# EAGLE design shield (EAGLE 6.5.0)
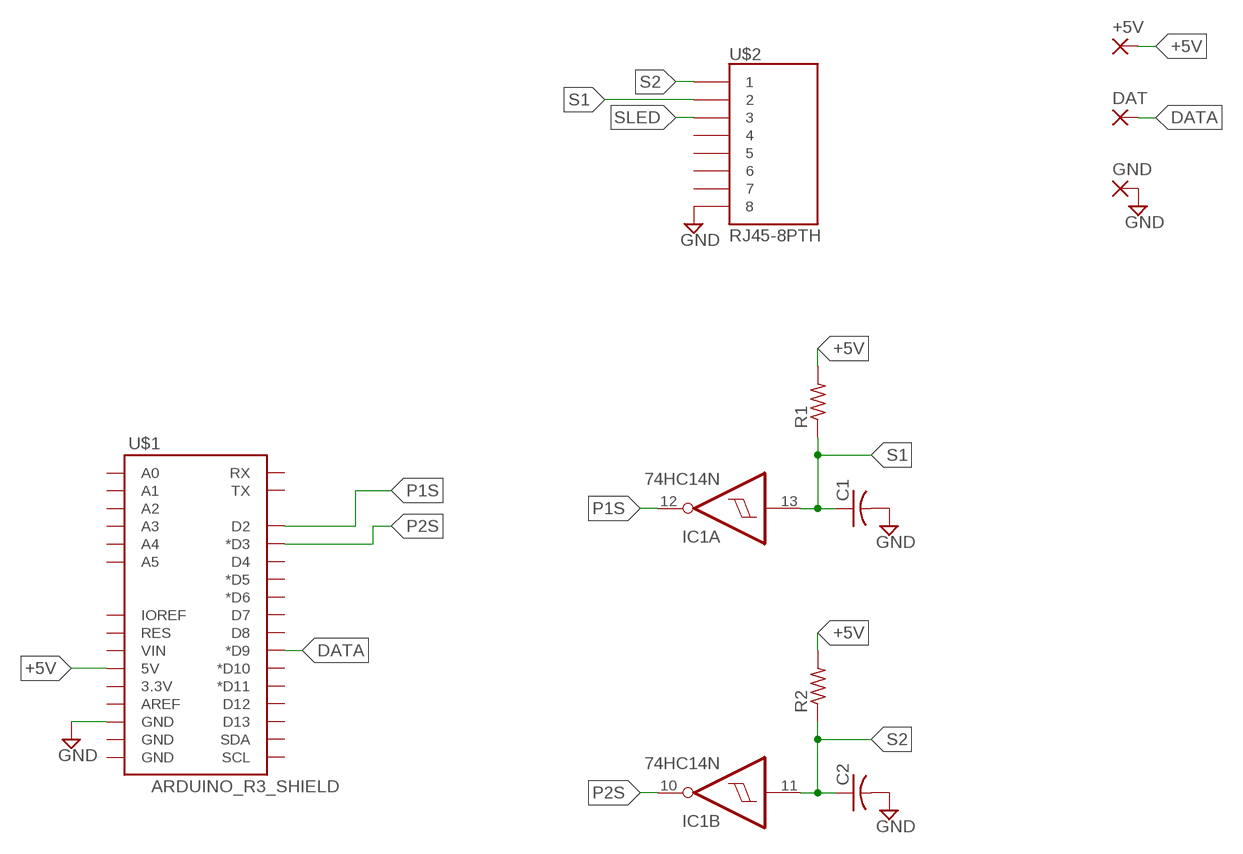
[diagram p0: schematic, sheet 1]

## Parts
+5V  WIREPAD2,15/1,0  [2,15/1,0]
C1  C-US025-025X050  [C025-025X050]
C2  C-US025-025X050  [C025-025X050]
DAT  WIREPAD2,15/1,0  [2,15/1,0]
GND  WIREPAD2,15/1,0  [2,15/1,0]
IC1  74HC14N  [DIL14]
R1  R-US_0207/7  [0207/7]
R2  R-US_0207/7  [0207/7]
U$1  ARDUINO_R3_SHIELD  [UNO_R3_SHIELD]
U$2  RJ45-8PTH  [RJ45-8]

## Nets
+5V: +5V.1(P) R1.2 R2.2 U$1.5V
DATA: DAT.1(P) U$1.D9(*D9)
GND: C1.2 C2.2 GND.1(P) U$1.GND@2(GND) U$2.8
P1S: IC1.12(A:O) U$1.D2
P2S: IC1.10(B:O) U$1.D3(*D3)
S1: C1.1 IC1.13(A:I) R1.1 U$2.2
S2: C2.1 IC1.11(B:I) R2.1 U$2.1
SLED: U$2.3
Unconnected: IC1.1(D:I) IC1.2(D:O) IC1.3(E:I) IC1.4(E:O) IC1.5(F:I) IC1.6(F:O) IC1.8(C:O) IC1.9(C:I) U$1.3.3V U$1.A0 U$1.A1 U$1.A2 U$1.A3 U$1.A4 U$1.A5 U$1.AREF U$1.D4 U$1.D5(*D5) U$1.D6(*D6) U$1.D7 U$1.D8 U$1.D10(*D10) U$1.D11(*D11) U$1.D12 U$1.D13 U$1.GND@0(GND) U$1.GND@1(GND) U$1.IOREF U$1.RES U$1.RX U$1.SCL U$1.SDA U$1.TX U$1.VIN U$2.4 U$2.5 U$2.6 U$2.7

## Power pins joined to a net without a drawn wire
GND: IC1.7(P:GND)
VCC: IC1.14(P:VCC)

## Library data of the parts
+5V DAT GND = wirepad:WIREPAD: Wire PAD connect wire on PCB
C1 C2 = resistor:C-US: CAPACITOR, American symbol
IC1 = 74xx-eu:74*14: Hex schmitt trigger INVERTER
R1 R2 = resistor:R-US_: RESISTOR, American symbol
U$1 = SparkFun-Boards:ARDUINO_R3_SHIELD: Shield form compatible with the Arduino Uno R3.
U$2 = SparkFun-Connectors:RJ45-8: RJ45 Jack Simple RJ45, 8-pin connection - connector for common Cat5, Cat5e, and Cat6 Ethernet cables. Footprint not yet proven in production. Connector sku is PRT-00643; Breakout PCB sku is BOB-00716.

## Board
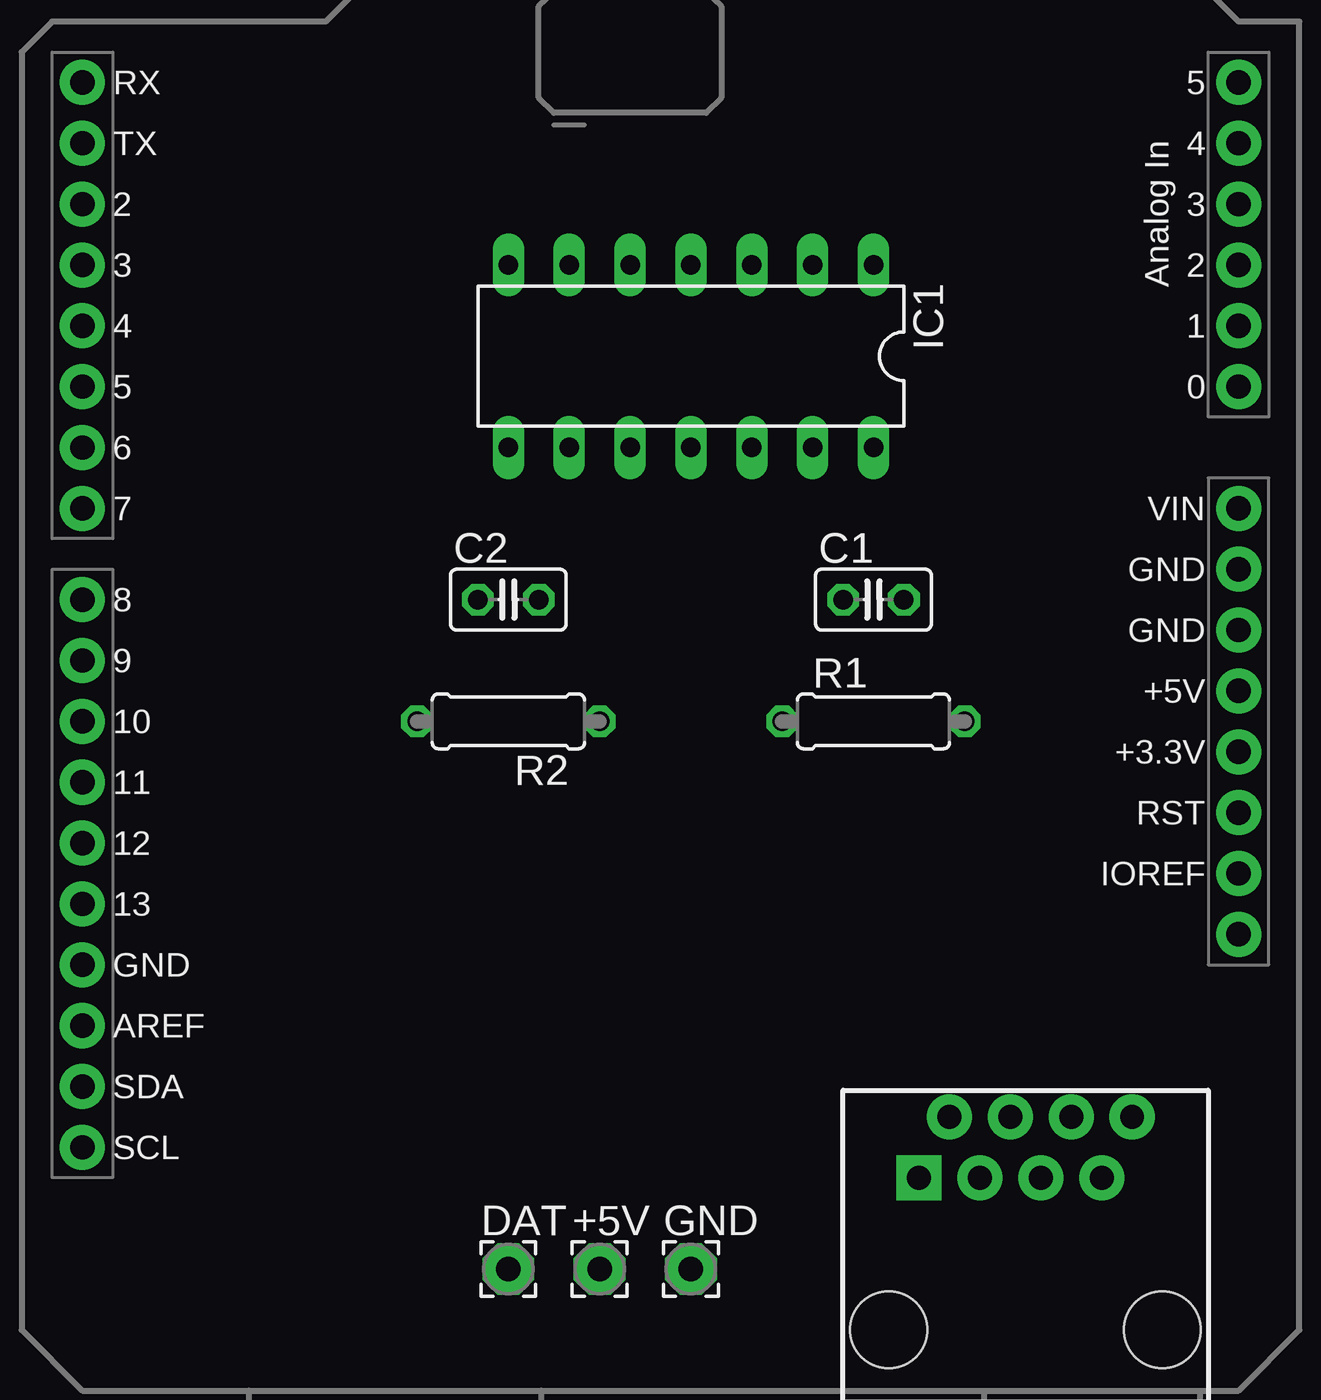
[diagram p1: board, top side]
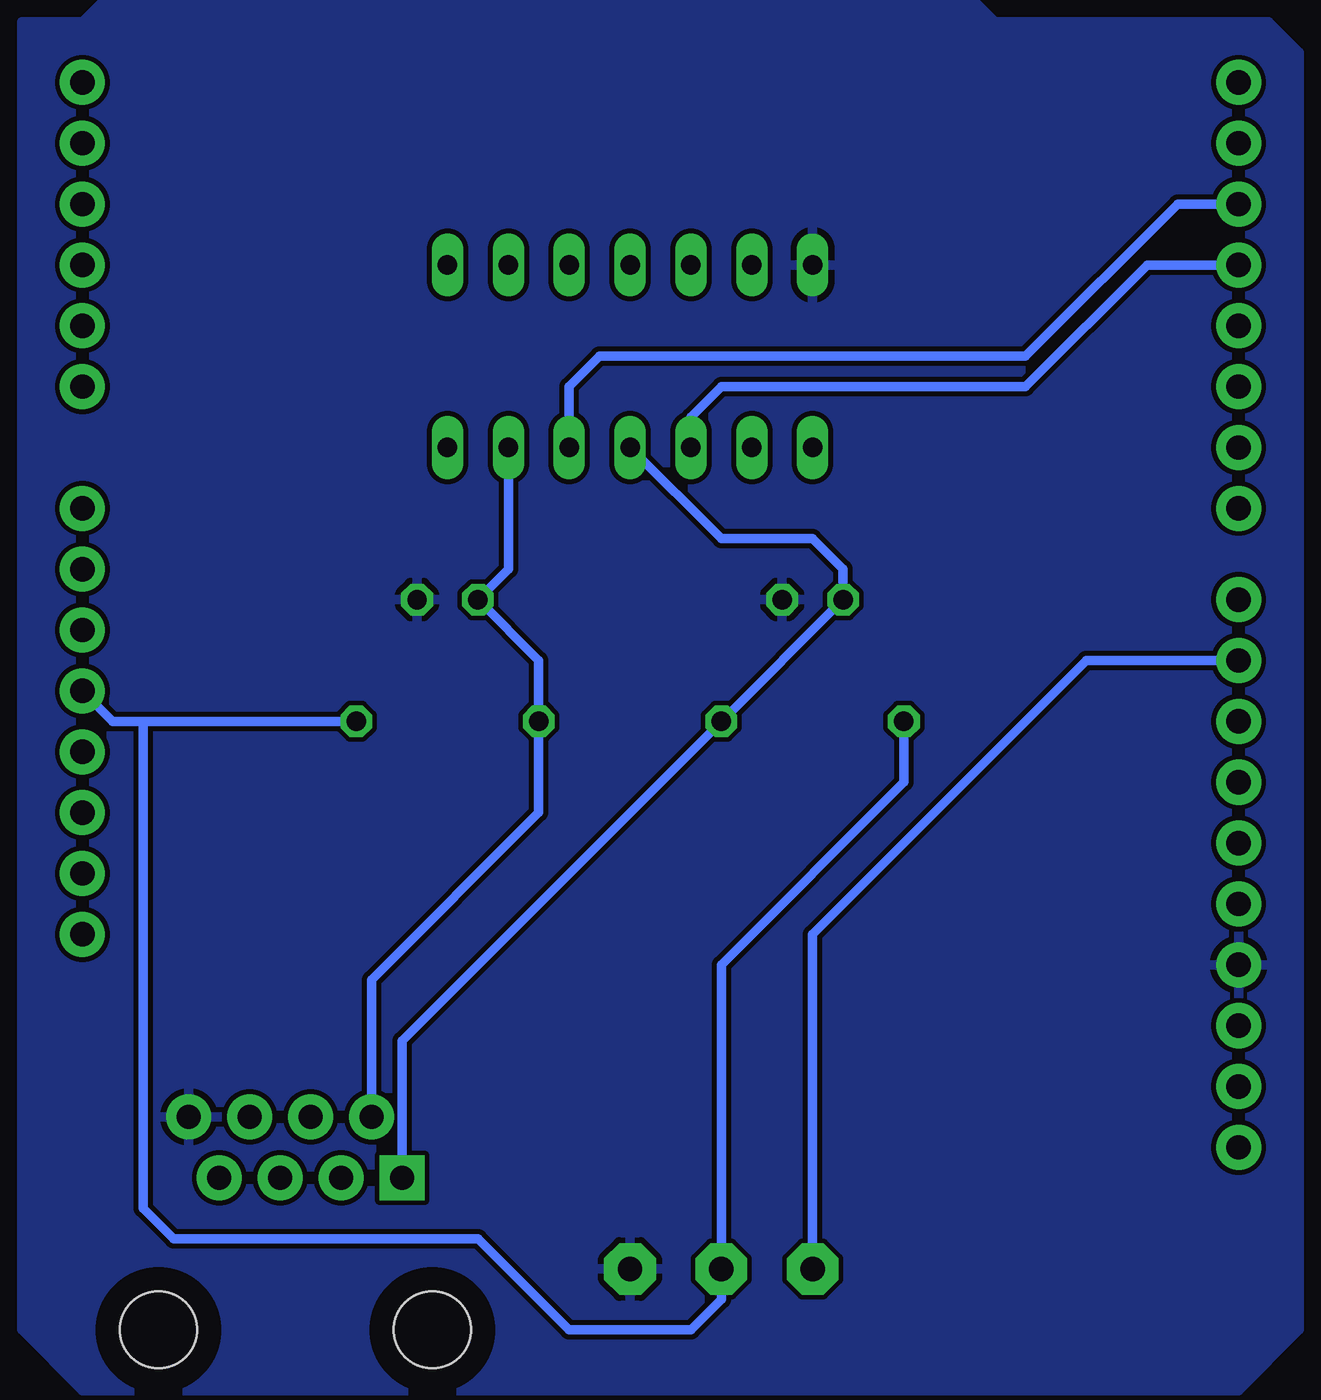
[diagram p2: board, bottom side, seen from below]

No outline drawn. Coordinates in mm, seen from the top.
Copper layers (1*16): Top 0.035mm / dielectric 1.5mm / Bottom 0.035mm
Design rules "default": minimum track width 10mil, minimum drill 24mil, track to track 8mil, track to pad 8mil, pad to pad 8mil, via to via 8mil, smd to smd 8mil, copper to edge 40mil, drill to drill 8mil, minimum pad ring 10mil, minimum via ring 8mil, stop-mask expansion 4mil, vias tented up to drill 0mil, thermal gap 10mil

### Footprints (pad centres in the part's own frame; a part is rotated, then mirrored left to right if it is on the bottom)
2,15/1,0 = drill 1.016 pad 2.159 octagon: 1 0,0
C025-025X050 = drill 0.813 octagon: 1 -1.27,0; 2 1.27,0
DIL14 = drill 0.813 long: 1 -7.62,-3.81; 2 -5.08,-3.81; 3 -2.54,-3.81; 4 0,-3.81; 5 2.54,-3.81; 6 5.08,-3.81; 7 7.62,-3.81; 8 7.62,3.81; 9 5.08,3.81; 10 2.54,3.81; 11 0,3.81; 12 -2.54,3.81; 13 -5.08,3.81; 14 -7.62,3.81
0207/7 = drill 0.813 octagon: 1 -3.81,0; 2 3.81,0
UNO_R3_SHIELD = drill 1.016 pad 1.88: 3.3V 50.8,26.67; 5V 50.8,29.21; A0 50.8,41.91; A1 50.8,44.45; A2 50.8,46.99; A3 50.8,49.53; A4 50.8,52.07; A5 50.8,54.61; AREF 2.54,15.24; D2 2.54,49.53; D3 2.54,46.99; D4 2.54,44.45; D5 2.54,41.91; D6 2.54,39.37; D7 2.54,36.83; D8 2.54,33.02; D9 2.54,30.48; D10 2.54,27.94; D11 2.54,25.4; D12 2.54,22.86; D13 2.54,20.32; GND@0 50.8,31.75; GND@1 50.8,34.29; GND@2 2.54,17.78; IOREF 50.8,21.59; NC 50.8,19.05; RES 50.8,24.13; RX 2.54,54.61; SCL 2.54,10.16; SDA 2.54,12.7; TX 2.54,52.07; VIN 50.8,36.83
RJ45-8 = drill 1 pad 1.88 square: 1 -4.445,6.35 | drill 1 pad 1.88: 2 -3.175,8.89; 3 -1.905,6.35; 4 -0.635,8.89; 5 0.635,6.35; 6 1.905,8.89; 7 3.175,6.35; 8 4.445,8.89 | hole 3.2: -5.715,0; 5.715,0

### Placement (x,y rotation side)
+5V  24.13,5.08 0 top
C1  35.56,33.02 0 top
C2  20.32,33.02 0 top
DAT  20.32,5.08 0 top
GND  27.94,5.08 0 top
IC1  27.94,43.18 180 top
R1  35.56,27.94 0 top
R2  20.32,27.94 180 top
U$1  0,0 0 top
U$2  41.91,2.54 0 top

### Tracks (layer width: path | path; a pad name or v marks a point on that pad's centre or on a via)
+5V
  Bottom 0.406: U$1.5V 49.53,27.94 48.26,27.94 | 48.26,27.94 R1.2 | 48.26,27.94 48.26,7.62 46.99,6.35 34.29,6.35 30.48,2.54 25.4,2.54 24.13,3.81 +5V.1 24.13,17.78 16.51,25.4 R2.2
DATA
  Bottom 0.406: DAT.1 20.32,19.05 8.89,30.48 U$1.D9
GND
  pour Bottom: 15.24,59.69 48.26,59.69 50.8,57.15 53.34,57.15 53.34,2.54 50.8,0 2.54,0 0,2.54 0,55.88 1.27,57.15 12.7,57.15
P1S
  Bottom 0.406: IC1.12 30.48,41.91 29.21,43.18 11.43,43.18 5.08,49.53 U$1.D2
P2S
  Bottom 0.406: IC1.10 25.4,40.64 24.13,41.91 11.43,41.91 6.35,46.99 U$1.D3
S1
  Bottom 0.406: U$2.2 38.73,17.14 31.75,24.13 R1.1 31.75,30.48 C1.1 33.02,34.29 IC1.13
S2
  Bottom 0.406: U$2.1 37.47,14.61 R2.1 C2.1 19.05,34.29 20.32,35.56 24.13,35.56 IC1.11